# EAGLE schematic humidity (EAGLE 7.3.0)
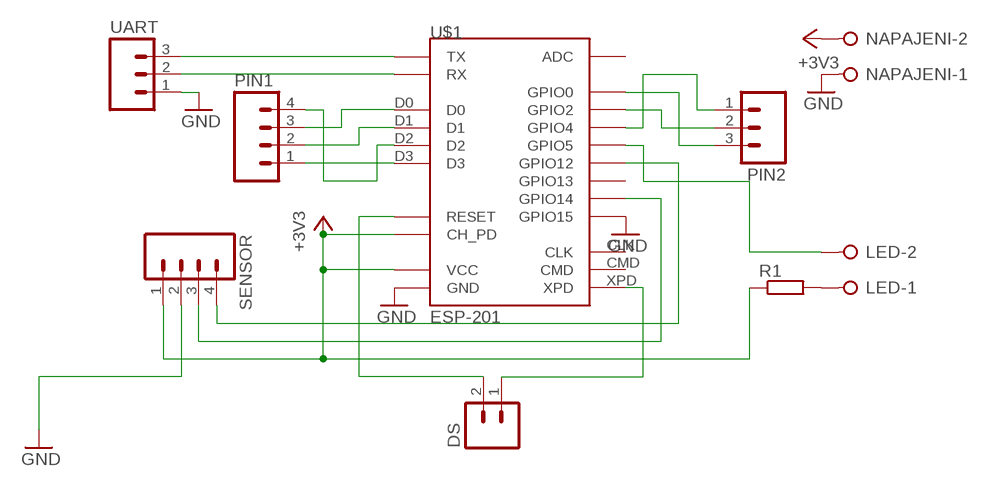
[diagram p0: schematic, sheet 1]

## Parts
DS  M02  [02P]
LED  W237-02P  [W237-132]
NAPAJENI  W237-02P  [W237-132]
PIN1  M04  [04P]
PIN2  M03  [03P]
R1  R-EU_0207/7  [0207/7]
SENSOR  M04  [04P]
U$1  ESP-201  [ESP-201]
UART  M03  [03P]

## Nets
+3V3: NAPAJENI.2 R1.1 SENSOR.1 U$1.3V3(VCC) U$1.3V3_2(VCC) U$1.3V3_3(VCC) U$1.CH_PD
GND: NAPAJENI.1 SENSOR.2 U$1.GND U$1.GND_2(GND) U$1.GND_3(GND) U$1.GPIO15 UART.1
N$1: PIN1.1 U$1.D3
N$2: DS.2 U$1.RST(RESET)
N$3: SENSOR.3 U$1.GPIO14
N$4: SENSOR.4 U$1.GPIO12
N$5: DS.1 U$1.XPD
N$6: U$1.TX UART.3
N$7: U$1.RX UART.2
N$8: PIN1.2 U$1.D1
N$9: PIN1.3 U$1.D0
N$10: PIN1.4 U$1.D2
N$11: PIN2.3 U$1.GPIO0
N$12: PIN2.2 U$1.GPIO2
N$13: LED.1 R1.2
N$14: PIN2.1 U$1.GPIO4
N$15: LED.2 U$1.GPIO5
Unconnected: U$1.ADC U$1.CLK U$1.CMD U$1.GPIO13

## Library data of the parts
DS = con-amp-quick:M02: AMP QUICK CONNECTOR; OC_FARNELL: unknown; OC_NEWARK: unknown
LED NAPAJENI = con-wago-508:W237-02P: WAGO SREW CLAMP; OC_FARNELL: unknown; OC_NEWARK: unknown
PIN1 SENSOR = con-amp-quick:M04: AMP QUICK CONNECTOR; OC_FARNELL: unknown; OC_NEWARK: unknown
PIN2 UART = con-amp-quick:M03: AMP QUICK CONNECTOR; OC_FARNELL: unknown; OC_NEWARK: unknown
R1 = rcl:R-EU_: RESISTOR, European symbol
U$1 = esp8266:ESP-201: ESP8266 Wifi Module ESP-201; DIMENSIONS: 25 x 35 mm; PINS: 26; PITCH: 0.1" / 2.54 mm